# EAGLE schematic Nixie_Clock (EAGLE 8.0.1)
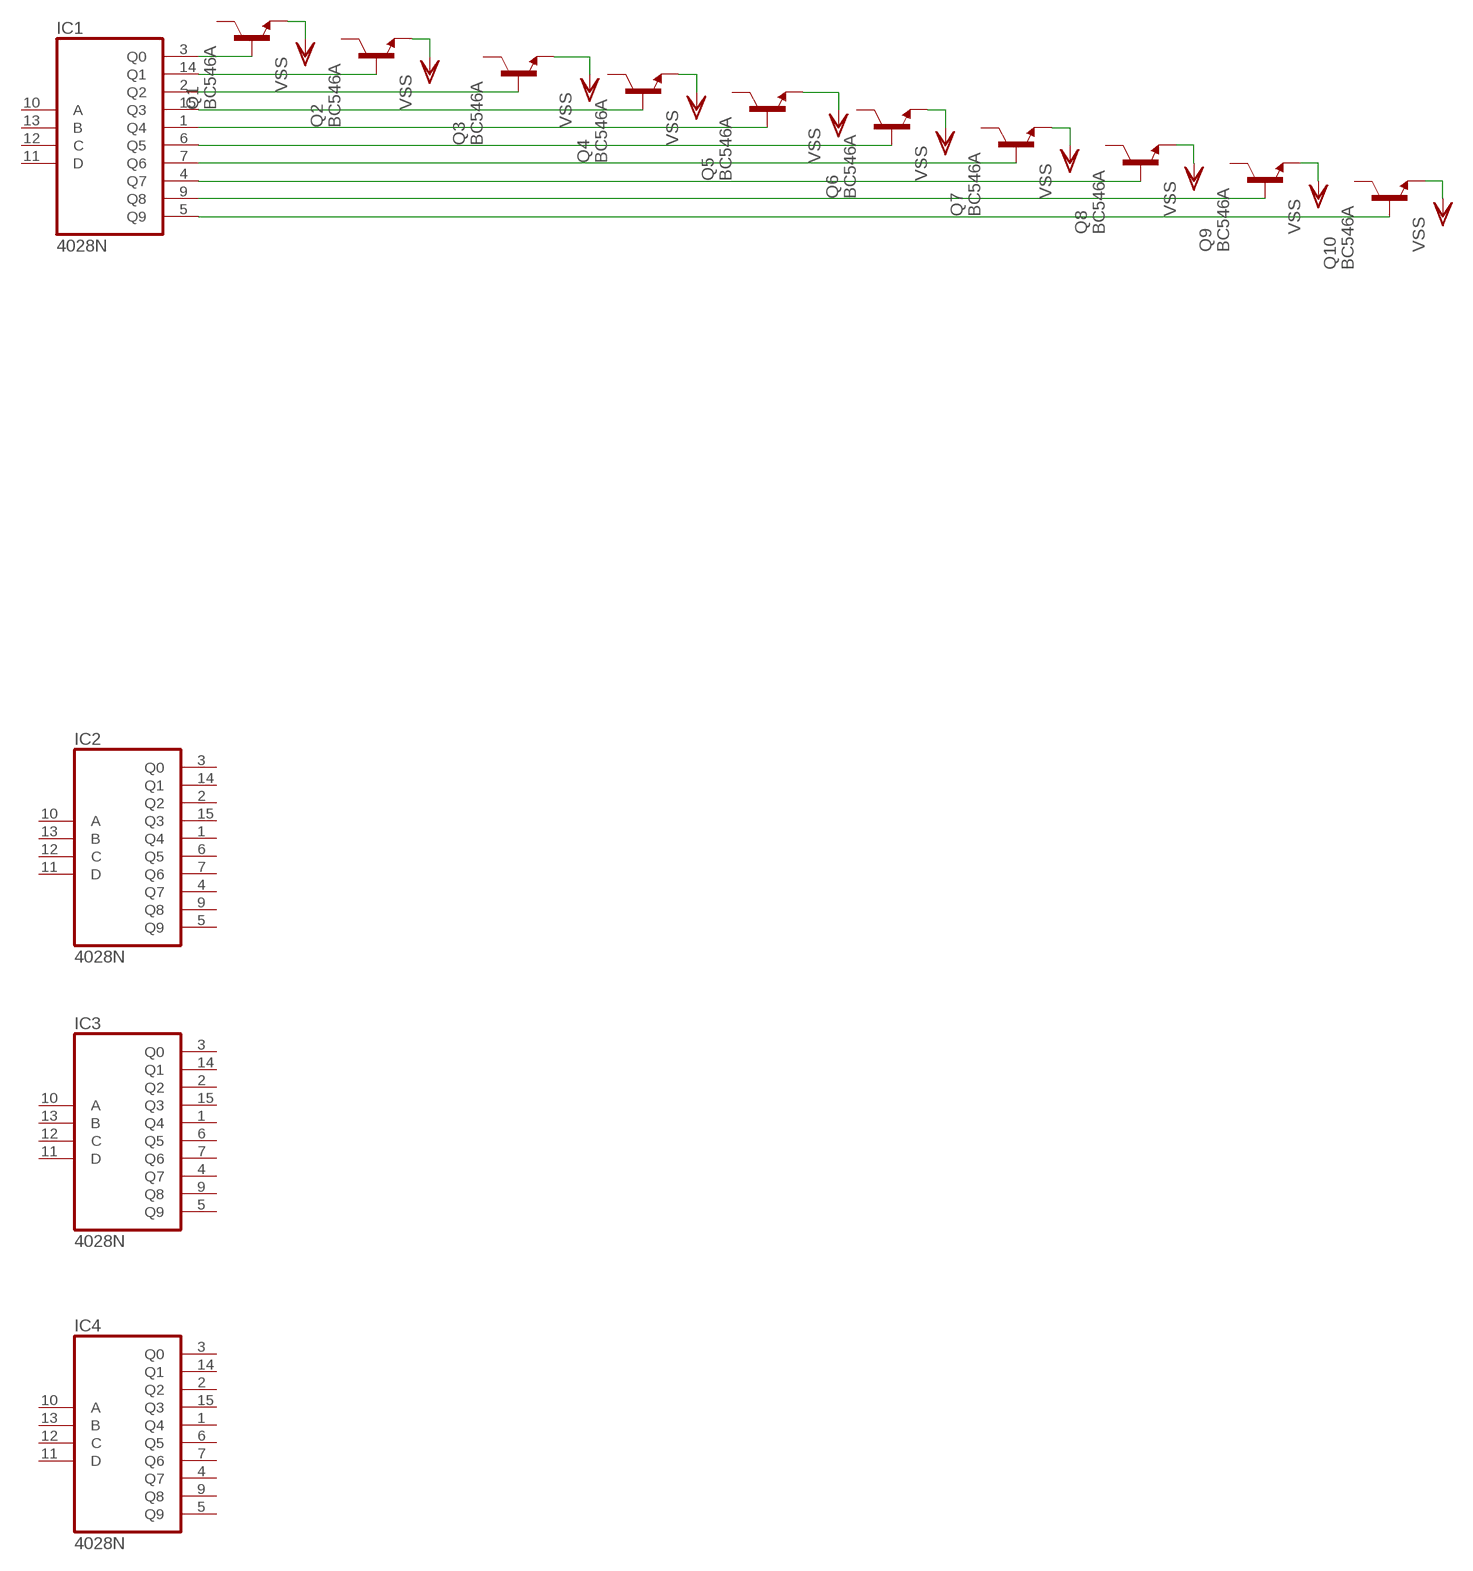
[diagram p0: schematic, sheet 1]

## Parts
IC1  4028N  [DIL16]
IC2  4028N  [DIL16]
IC3  4028N  [DIL16]
IC4  4028N  [DIL16]
Q1  BC546A  [TO92-EBC]
Q2  BC546A  [TO92-EBC]
Q3  BC546A  [TO92-EBC]
Q4  BC546A  [TO92-EBC]
Q5  BC546A  [TO92-EBC]
Q6  BC546A  [TO92-EBC]
Q7  BC546A  [TO92-EBC]
Q8  BC546A  [TO92-EBC]
Q9  BC546A  [TO92-EBC]
Q10  BC546A  [TO92-EBC]

## Nets
N$1: IC1.5(Q9) Q10.B
N$2: IC1.9(Q8) Q9.B
N$3: IC1.4(Q7) Q8.B
N$4: IC1.7(Q6) Q7.B
N$5: IC1.6(Q5) Q6.B
N$6: IC1.1(Q4) Q5.B
N$7: IC1.15(Q3) Q4.B
N$8: IC1.2(Q2) Q3.B
N$9: IC1.14(Q1) Q2.B
N$10: IC1.3(Q0) Q1.B
VSS: Q1.E Q2.E Q3.E Q4.E Q5.E Q6.E Q7.E Q8.E Q9.E Q10.E
Unconnected: IC1.10(A) IC1.11(D) IC1.12(C) IC1.13(B) IC2.1(Q4) IC2.2(Q2) IC2.3(Q0) IC2.4(Q7) IC2.5(Q9) IC2.6(Q5) IC2.7(Q6) IC2.9(Q8) IC2.10(A) IC2.11(D) IC2.12(C) IC2.13(B) IC2.14(Q1) IC2.15(Q3) IC3.1(Q4) IC3.2(Q2) IC3.3(Q0) IC3.4(Q7) IC3.5(Q9) IC3.6(Q5) IC3.7(Q6) IC3.9(Q8) IC3.10(A) IC3.11(D) IC3.12(C) IC3.13(B) IC3.14(Q1) IC3.15(Q3) IC4.1(Q4) IC4.2(Q2) IC4.3(Q0) IC4.4(Q7) IC4.5(Q9) IC4.6(Q5) IC4.7(Q6) IC4.9(Q8) IC4.10(A) IC4.11(D) IC4.12(C) IC4.13(B) IC4.14(Q1) IC4.15(Q3) Q1.C Q2.C Q3.C Q4.C Q5.C Q6.C Q7.C Q8.C Q9.C Q10.C

## Power pins joined to a net without a drawn wire
VDD: IC1.16(VDD) IC2.16(VDD) IC3.16(VDD) IC4.16(VDD)
VSS: IC1.8(VSS) IC2.8(VSS) IC3.8(VSS) IC4.8(VSS)

## Library data of the parts
IC1-IC4 = 40xx:4028: BCD to decimal DECODER
Q1-Q10 = transistor-npn:BC546*: NPN Transistor